# Altium schematic sheet ADC_CH_A.SchDoc
size A4; SheetNumber: 10; SheetTotal: 11
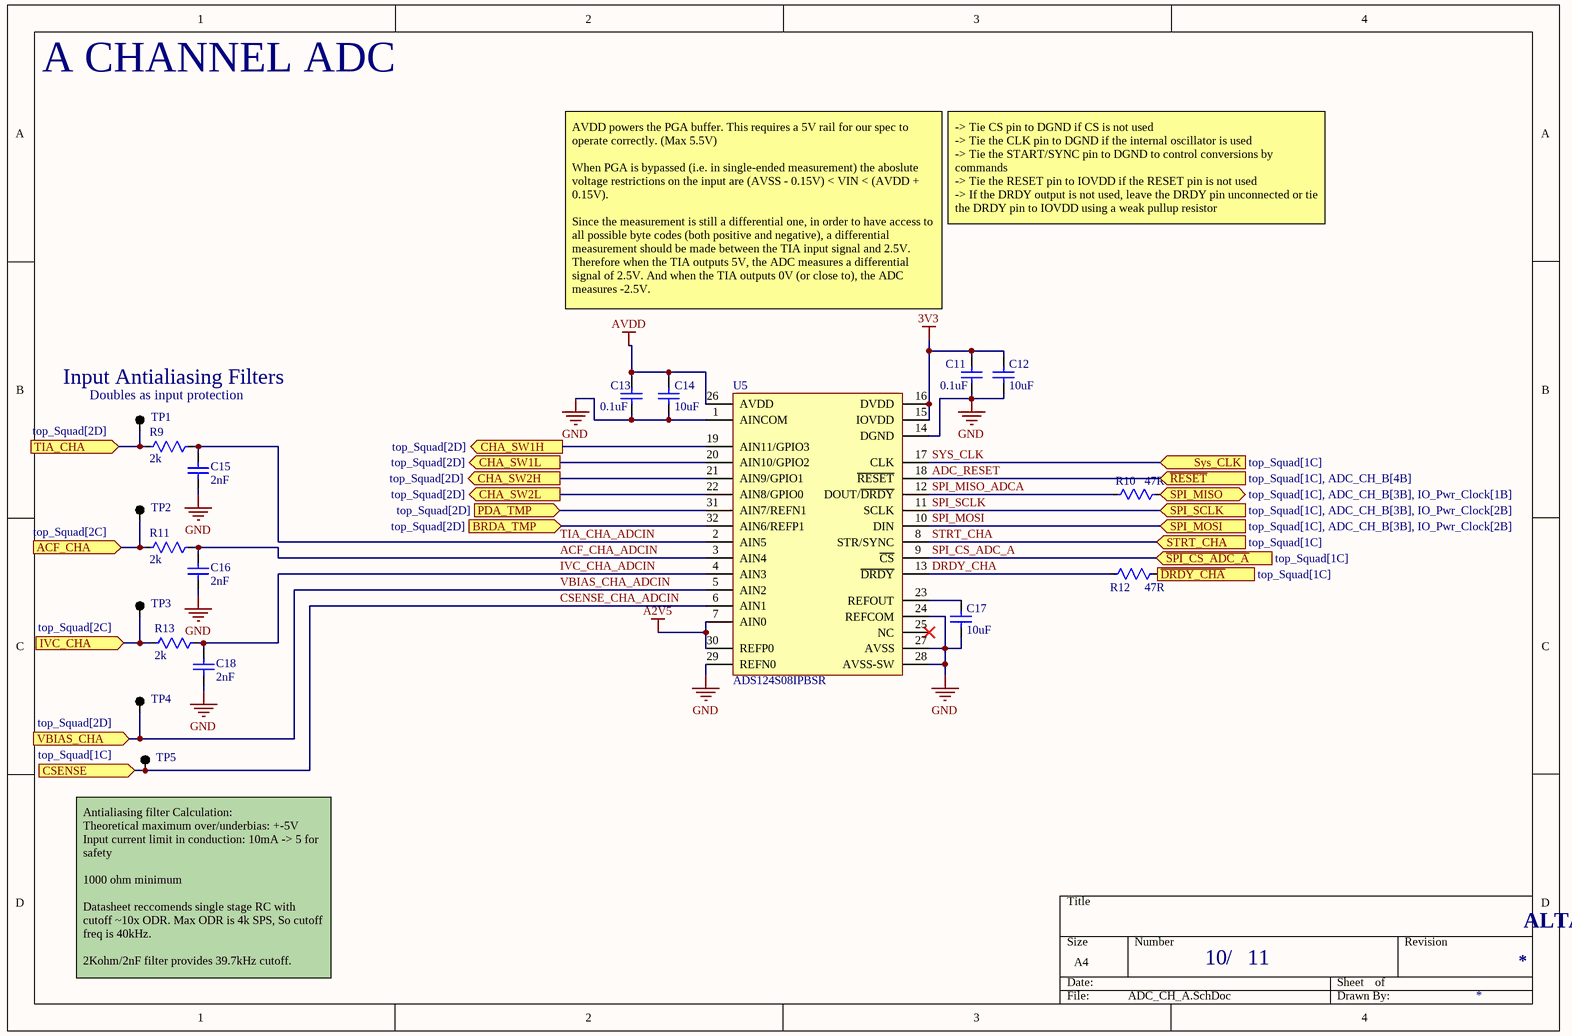
[diagram p0: ADC_CH_A.SchDoc]

## Parts
C11  0.1uF  [CAP 0603 IPC MID DENSITY]
C12  10uF  [CAP 0805 IPC MID DENSITY]
C13  0.1uF  [CAP 0603 IPC MID DENSITY]
C14  10uF  [CAP 0805 IPC MID DENSITY]
C15  2nF  [CAP 0603 IPC MID DENSITY]
C16  2nF  [CAP 0603 IPC MID DENSITY]
C17  10uF  [CAP 0805 IPC MID DENSITY]
C18  2nF  [CAP 0603 IPC MID DENSITY]
R9  2k  [RES 0603 IPC MID DENSITY]
R10  47R  [RES 0402 NON-IPC SEI]
R11  2k  [RES 0603 IPC MID DENSITY]
R12  47R  [RES 0402 NON-IPC SEI]
R13  2k  [RES 0603 IPC MID DENSITY]
TP1  Testpoint  [TESTPOINT THT]  (value not drawn)  (no BOM)
TP2  Testpoint  [TESTPOINT THT]  (value not drawn)  (no BOM)
TP3  Testpoint  [TESTPOINT THT]  (value not drawn)  (no BOM)
TP4  Testpoint  [TESTPOINT THT]  (value not drawn)  (no BOM)
TP5  Testpoint  [TESTPOINT THT]  (value not drawn)  (no BOM)
U5  ADS124S08IPBSR  [32TQFP 7X7MM IPC LOW DENSITY]

## Ports
ACF_CHA (in, see top_Squad[2C]), BRDA_TMP (in, see top_Squad[2D]), CHA_SW1H (out, see top_Squad[2D]), CHA_SW1L (out, see top_Squad[2D]), CHA_SW2H (out, see top_Squad[2D]), CHA_SW2L (out, see top_Squad[2D]), CSENSE (in, see top_Squad[1C]), IVC_CHA (in, see top_Squad[2C]), PDA_TMP (in, see top_Squad[2D]), SPI_MISO (bidir, see top_Squad[1C], ADC_CH_B[3B], IO_Pwr_Clock[1B]), SPI_MOSI (in, see top_Squad[1C], ADC_CH_B[3B], IO_Pwr_Clock[2B]), SPI_SCLK (in, see top_Squad[1C], ADC_CH_B[3B], IO_Pwr_Clock[2B]), STRT_CHA (in, see top_Squad[1C]), Sys_CLK (in, see top_Squad[1C]), TIA_CHA (in, see top_Squad[2D]), VBIAS_CHA (in, see top_Squad[2D]), ~{DRDY_CHA} (out, see top_Squad[1C]), ~{RESET} (in, see top_Squad[1C], ADC_CH_B[4B]), ~{SPI_CS_ADC_A} (in, see top_Squad[1C])

## Nets
3V3: C11.2 C12.2 U5.15(IOVDD) U5.16(DVDD)
A2V5: U5.7(AIN0) U5.30(REFP0)
AVDD: C13.2 C14.2 U5.26(AVDD)
GND: C11.1 C12.1 C13.1 C14.1 C15.1 C16.1 C17.1 C18.1 U5.1(AINCOM) U5.14(DGND) U5.24(REFCOM) U5.27(AVSS) U5.28(AVSS-SW) U5.29(REFN0)
~{DRDY_CHA}: R12.2 ; port ~{DRDY_CHA}
ACF_CHA: R11.1 TP2.1 ; port ACF_CHA
ACF_CHA_ADCIN: C16.2 R11.2 U5.3(AIN4)
ADC_RESET: U5.18(~{RESET}) ; port ~{RESET}
BRDA_TMP: U5.32(AIN6/REFP1) ; port BRDA_TMP
CHA_SW1H: U5.19(AIN11/GPIO3) ; port CHA_SW1H
CHA_SW1L: U5.20(AIN10/GPIO2) ; port CHA_SW1L
CHA_SW2H: U5.21(AIN9/GPIO1) ; port CHA_SW2H
CHA_SW2L: U5.22(AIN8/GPIO0) ; port CHA_SW2L
CSENSE_CHA_ADCIN: TP5.1 U5.6(AIN1) ; port CSENSE
DRDY_CHA: R12.1 U5.13(~{DRDY})
IVC_CHA: R13.1 TP3.1 ; port IVC_CHA
IVC_CHA_ADCIN: C18.2 R13.2 U5.4(AIN3)
PDA_TMP: U5.31(AIN7/REFN1) ; port PDA_TMP
SPI_CS_ADC_A: U5.9(~{CS}) ; port ~{SPI_CS_ADC_A}
SPI_MISO: R10.2 ; port SPI_MISO
SPI_MISO_ADCA: R10.1 U5.12(DOUT/~{DRDY})
SPI_MOSI: U5.10(DIN) ; port SPI_MOSI
SPI_SCLK: U5.11(SCLK) ; port SPI_SCLK
STRT_CHA: U5.8(STR/SYNC) ; port STRT_CHA
SYS_CLK: U5.17(CLK) ; port Sys_CLK
TIA_CHA: R9.1 TP1.1 ; port TIA_CHA
TIA_CHA_ADCIN: C15.2 R9.2 U5.2(AIN5)
VBIAS_CHA_ADCIN: TP4.1 U5.5(AIN2) ; port VBIAS_CHA
NetC17_2: C17.2 U5.23(REFOUT)

Not connected (* = marked no-connect by the designer): U5 25(NC)*

## Notes on the sheet
- A CHANNEL ADC
- -> Tie CS pin to DGND if CS is not used
  -> Tie the CLK pin to DGND if the internal oscillator is used
  -> Tie the START/SYNC pin to DGND to control conversions by commands
  -> Tie the RESET pin to IOVDD if the RESET pin is not used
  -> If the DRDY output is not used, leave the DRDY pin unconnected or tie the DRDY pin to IOVDD using a weak pullup resistor
- AVDD powers the PGA buffer. This requires a 5V rail for our spec to operate correctly. (Max 5.5V)
  When PGA is bypassed (i.e. in single-ended measurement) the aboslute voltage restrictions on the input are (AVSS - 0.15V) < VIN < (AVDD + 0.15V).
  Since the measurement is still a differential one, in order to have access to all possible byte codes (both positive and negative), a differential measurement should be made between the TIA input signal and 2.5V. Therefore when the TIA outputs 5V, the ADC measures a differential signal of 2.5V. And when the TIA outputs 0V (or close to), the ADC measures -2.5V.
- (near TP1) Input Antialiasing Filters
- (near TP1) Doubles as input protection
- (near TP5) Antialiasing filter Calculation:
  Theoretical maximum over/underbias: +-5V
  Input current limit in conduction: 10mA -> 5 for safety
  1000 ohm minimum
  Datasheet reccomends single stage RC with cutoff ~10x ODR. Max ODR is 4k SPS, So cutoff freq is 40kHz.
  2Kohm/2nF filter provides 39.7kHz cutoff.
- /
- ALTAIR PhotoDiode ReadOut (PDRO) - Squad

## Library data of the parts
C11 C13 = CAP: Kemet C0603C104K5RACAUTO - Cap Ceramic 0.1uF 50V X7R 10% 0603 125C Paper T/R; MF: Kemet; MP: C0603C104K5RACAUTO
C12 C14 C17 = CAP: Murata GRM21BR61E106KA73L - Cap Ceramic 10uF 10% 25V X5R 0805; MF: Murata; MP: GRM21BR61E106KA73L
C15 C16 C18 = CAP: Murata GCM1885C1H202FA16J 50V 2nF C0G ±1% 0603; MF: Murata; MP: GCM1885C1H202FA16J
R9 R11 R13 = RES: Panasonic ERJ-3EKF2001V Res Thick Film 0603 2K Ohm 1% 1/10W ±100ppm/°C; MF: Panasonic Electronic Components; MP: ERJ-3EKF2001V
R10 R12 = RES: Stackpole RMCF0402JT47R0 - Res 47Ohm 5% 0.063W 0402 Thick Film AEC-Q200 compliant; MF: Stackpole Electronics Inc.; MP: RMCF0402JT47R0
U5 = ADS124S08IPBSR: 24BIT ADC Delta-Sigma 4k samples/s PGA V-reference; Interface: SPI; Number of Inputs: 12; Number of Bits: 24; Sampling Rate: 4000S/s; Number of A/D Converters: 1; MF: Texas Instruments; RoHS: No; Category: Analog to Digital Converters (ADCs); Stock 1: 2523; Mount: Surface Mount; Case/Package: LQFP; Number of Pins: 32; Min Operating Temperature: -50°C; Max Operating Temperature: 125°C; Packaging: Tape and Reel; ComponentLink1URL: http://www.ti.com/general/docs/lit/getliterature.tsp?genericPartNumber=ADS124S08&fileType=pdf&src-supplier=Farnell; ComponentLink1Description: http://www.ti.com/general/docs/lit/getliterature.tsp?genericPartNumber=ADS124S08&fileType=pdf&src-supplier=Farnell; ComponentLink2URL: http://www.ti.com/lit/ds/symlink/ads124s06.pdf?src-supplier=Digi-Key; ComponentLink2Description: http://www.ti.com/lit/ds/symlink/ads124s06.pdf?src-supplier=Digi-Key; Supplier 1: Digi-Key; Supplier Part Number 1: 296-45170-1-ND; MP: ADS124S08IPBSR